# Altium project GR_Alim.PrjPCB
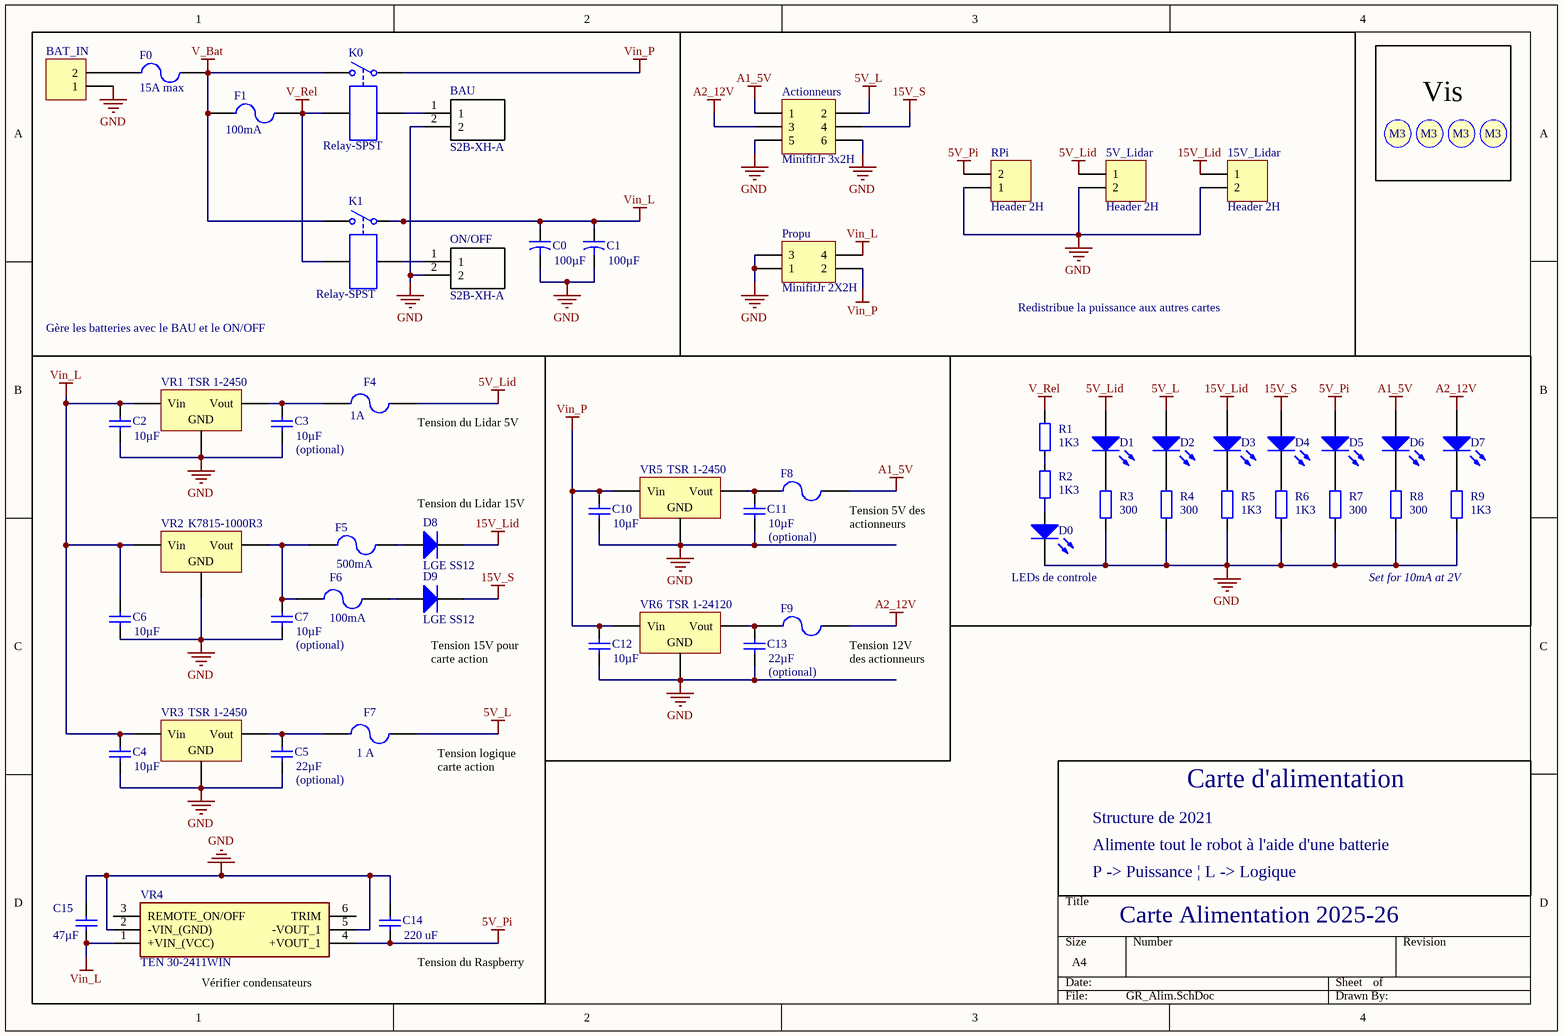
[diagram p0: GR_Alim.SchDoc]
1 sheet, 61 parts. Net scope: global (net labels, ports and power ports of the same name join across sheets).
Board file: GR_Alim.PcbDoc

## Sheet GR_Alim.SchDoc
size A4

### Parts
5V_Lidar  Header 2H  [S2B-XH-A]
15V_Lidar  Header 2H  [S2B-XH-A]
Actionneurs  MinifitJr 3x2H  [MOLEX_MINIFITJR_3X2]
BAT_IN  Battery Onboard Solder  [Battery SALE]  (value not drawn)
BAU  S2B-XH-A  [S2B-XH-A]
C0  value 100µF  [Condensateur]  (hidden comment: Cap2)
C1  value 100µF  [Condensateur]  (hidden comment: Cap2)
C2  value 10µF  [Capacitor 1206]  (hidden comment: Cap)
C3  (optional)  value 10µF  [Capacitor 1206]
C4  value 10µF  [Capacitor 1206]  (hidden comment: Cap)
C5  (optional)  value 22µF  [Capacitor 1206]
C6  value 10µF  [Capacitor 1206]  (hidden comment: Cap)
C7  (optional)  value 10µF  [Capacitor 1206]
C10  value 10µF  [Capacitor 1206]  (hidden comment: Cap)
C11  (optional)  value 10µF  [Capacitor 1206]
C12  value 10µF  [Capacitor 1206]  (hidden comment: Cap)
C13  (optional)  value 22µF  [Capacitor 1206]
C14  value 220 uF  [Capacitor 1206]  (hidden comment: Cap)
C15  value 47µF  [Capacitor 1206]  (hidden comment: Cap)
D0  V_Rel  [KP-3216SEC]  (value not drawn)
D1  5V_L  [KP-3216SEC]  (value not drawn)
D2  5V_Lid  [KP-3216SEC]  (value not drawn)
D3  A_2  [KP-3216SEC]  (value not drawn)
D4  5V_L  [KP-3216SEC]  (value not drawn)
D5  5V_L  [KP-3216SEC]  (value not drawn)
D6  A_1  [KP-3216SEC]  (value not drawn)
D7  A_2_12V  [KP-3216SEC]  (value not drawn)
D8  LGE SS12  [SMB]
D9  LGE SS12  [SMB]
F0  15A max  [Fuse]
F1  100mA  [3.5X2.8X1.9]
F4  1A  [3.5X2.8X1.9]
F5  500mA  [3.5X2.8X1.9]
F6  100mA  [3.5X2.8X1.9]
F7  1 A  [3.5X2.8X1.9]
F8  Fuse 2  [3.5X2.8X1.9]  (value not drawn)
F9  Fuse 2  [3.5X2.8X1.9]  (value not drawn)
K0  Relay-SPST  [Relay]
K1  Relay-SPST  [Relay]
ON/OFF  S2B-XH-A  [S2B-XH-A]
Propu  MinifitJr 2X2H  [MOLEX_MINIFITJR_2X2H]
R1  value 1K3  [Resistor 1206]  (hidden comment: Res2)
R2  value 1K3  [Resistor 1206]  (hidden comment: Res2)
R3  value 300  [Resistor 1206]  (hidden comment: Res2)
R4  value 300  [Resistor 1206]  (hidden comment: Res2)
R5  value 1K3  [Resistor 1206]  (hidden comment: Res2)
R6  value 1K3  [Resistor 1206]  (hidden comment: Res2)
R7  value 300  [Resistor 1206]  (hidden comment: Res2)
R8  300  [Resistor 1206]
R9  1K3  [Resistor 1206]
RPi  Header 2H  [Molex_MiniFitJr_2x1H]
S1  Screw M3  [Screw M3]  (value not drawn)
S2  Screw M3  [Screw M3]  (value not drawn)
S3  Screw M3  [Screw M3]  (value not drawn)
S4  Screw M3  [Screw M3]  (value not drawn)
VR1  TSR 1-2450  [TRS]
VR2  K7815-1000R3  [TRS]
VR3  TSR 1-2450  [TRS]
VR4  TEN 30-2411WIN  [TEN302411WIN]
VR5  TSR 1-2450  [TRS]
VR6  TSR 1-24120  [TRS]

### Blocks framed on the sheet
Gère les batteries avec le BAU et le ON/OFF: BAT_IN BAU C0 C1 F0 F1 K0 K1 ON/OFF
Redistribue la puissance aux autres cartes: 5V_Lidar 15V_Lidar Actionneurs Propu RPi

### Nets
5V_L: Actionneurs.2 D2.1(A) F7.2
5V_Lid: 5V_Lidar.1 D1.1(A) F4.2
5V_Pi: C14.1 D5.1(A) RPi.2 VR4.4(+VOUT_1)
15V_Lid: 15V_Lidar.1 D3.1(A) D8.2(K)
15V_S: Actionneurs.4 D4.1(A) D9.2(K)
A1_5V: Actionneurs.1 D6.1(A) F8.2
A2_12V: Actionneurs.3 D7.1(A) F9.2
GND: 5V_Lidar.2 15V_Lidar.2 Actionneurs.5 Actionneurs.6 BAT_IN.1 BAU.2 C0.2 C1.2 C2.1 C3.1 C4.1 C5.1 C6.1 C7.1 C10.1 C11.1 C12.1 C13.1 C14.2 C15.2 D0.2(K) ON/OFF.2 Propu.1 Propu.3 R3.1 R4.1 R5.2 R6.2 R7.2 R8.2 R9.2 RPi.1 VR1.2(GND) VR2.2(GND) VR3.2(GND) VR4.2(-VIN_(GND)) VR4.5(-VOUT_1) VR5.2(GND) VR6.2(GND)
V_Bat: F0.2 F1.1 K0.2 K1.2
V_Rel: F1.2 K0.4 K1.4 R1.1
Vin_L: C0.1 C1.1 C2.2 C4.2 C6.2 C15.1 K1.1 Propu.4 VR1.1(Vin) VR2.1(Vin) VR3.1(Vin) VR4.1(+VIN_(VCC))
Vin_P: C10.2 C12.2 K0.1 Propu.2 VR5.1(Vin) VR6.1(Vin)
NetBAT_IN_2: BAT_IN.2 F0.1
NetBAU_1: BAU.1 K0.3
NetC3_2: C3.2 F4.1 VR1.3(Vout)
NetC5_2: C5.2 F7.1 VR3.3(Vout)
NetC7_2: C7.2 F5.1 F6.1 VR2.3(Vout)
NetC11_2: C11.2 F8.1 VR5.3(Vout)
NetC13_2: C13.2 F9.1 VR6.3(Vout)
NetD0_1: D0.1(A) R2.2
NetD1_2: D1.2(K) R3.2
NetD2_2: D2.2(K) R4.2
NetD3_2: D3.2(K) R5.1
NetD4_2: D4.2(K) R6.1
NetD5_2: D5.2(K) R7.1
NetD6_2: D6.2(K) R8.1
NetD7_2: D7.2(K) R9.1
NetD8_1: D8.1(A) F5.2
NetD9_1: D9.1(A) F6.2
NetK1_3: K1.3 ON/OFF.1
NetR1_2: R1.2 R2.1

Not connected (* = marked no-connect by the designer): VR4 3(REMOTE_ON/OFF) 6(TRIM)

### Notes on the sheet
- Vis
- (near F4) Tension du Lidar 5V
- Tension du Lidar 15V
- (near F8) Tension 5V des actionneurs
- LEDs de controle
- Set for 10mA at 2V
- (near D9) Tension 15V pour carte action
- (near F9) Tension 12V des actionneurs
- (near F7) Tension logique carte action
- Carte d'alimentation
- Structure de 2021
- Alimente tout le robot à l'aide d'une batterie
- P -> Puissance | L -> Logique
- Carte Alimentation 2025-26
- (near VR4) Vérifier condensateurs
- (near C14) Tension du Raspberry
- (in symbol Screw M3) M3

### Library data of the parts
5V_Lidar 15V_Lidar RPi = Header 2H: Header, 2-Pin, Right Angle; LatestRevisionDate: 17-Jul-2002; LatestRevisionNote: Re-released for DXP Platform.; Publisher: Altium Limited
Actionneurs = Header 3X2H: Header, 3-Pin, Dual row, Right Angle; LatestRevisionDate: 17-Jul-2002; LatestRevisionNote: Re-released for DXP Platform.; Publisher: Altium Limited
BAT_IN = Header 2: Header, 2-Pin / Battery Onboard Solder / 24V; LatestRevisionDate: 17-Jul-2002; LatestRevisionNote: Re-released for DXP Platform.; Publisher: Altium Limited
BAU ON/OFF = S2B-XH-A-1_LF__SN_: Connector; Manufacturer_Name: JST (JAPAN SOLDERLESS TERMINALS); Manufacturer_Part_Number: S2B-XH-A-1(LF)(SN); Datasheet Link: http://www.jst-mfg.com/product/pdf/eng/eXH.pdf; Height: 6.1mm; Arrow Part Number: S2B-XH-A-1(LF)(SN)
C0 C1 = Cap2: Capacitor; Published: 23-Sep-2002; PackageReference: CAPR5-4X5; Publisher: Altium Limited; PackageDescription: Capacitor; 2 Leads
C2-C7 C10-C15 = Cap: Capacitor; Published: 8-Jun-2000; LatestRevisionDate: 17-Jul-2002; LatestRevisionNote: Re-released for DXP Platform.; PackageReference: RAD-0.3; Publisher: Altium Limited; PackageDescription: Radial Cap, Thru-Hole; 2 Leads; 0.3 in Pin Spacing
D0-D7 = LED2: Typical RED, GREEN, YELLOW, AMBER GaAs LED; Published: 8-Jun-2000; LatestRevisionDate: 17-Jul-2002; LatestRevisionNote: Re-released for DXP Platform.; PackageVersion: Feb-2002; PackageReference: 3.2X1.6X1.1; Publisher: Altium Limited; PackageDescription: SM LED; 2 Flat Leads
D8 D9 = Diode: Default Diode; Published: 8-Jun-2000; LatestRevisionDate: 17-Jul-2002; LatestRevisionNote: Re-released for DXP Platform.; PackageVersion: Sep-1996; PackageReference: SMC; Publisher: Altium Limited; PackageDescription: DO-214-AB/SMC; 2 C-Bend Leads; Body 7.9 x 5.9 mm, inc. leads (LxW); Code_JEDEC: DO-214-AB
F0 = Fuse 2: Main Fuse; Published: 8-Jun-2000; LatestRevisionDate: 17-Jul-2002; LatestRevisionNote: Re-released for DXP Platform.; PackageReference: PIN-W2/E2.8; Publisher: Altium Limited; PackageDescription: Thru-Hole; 2 Leads
F1 = Fuse 2: Resettable fuse T0; Published: 8-Jun-2000; LatestRevisionDate: 17-Jul-2002; LatestRevisionNote: Re-released for DXP Platform.; PackageReference: PIN-W2/E2.8; Publisher: Altium Limited; PackageDescription: Thru-Hole; 2 Leads
F4 F5 = Fuse 2: Resettable Fuse αA / JF; Published: 8-Jun-2000; LatestRevisionDate: 17-Jul-2002; LatestRevisionNote: Re-released for DXP Platform.; PackageReference: PIN-W2/E2.8; Publisher: Altium Limited; PackageDescription: Thru-Hole; 2 Leads
F6 = Fuse 2: Resettable Fuse T0; Published: 8-Jun-2000; LatestRevisionDate: 17-Jul-2002; LatestRevisionNote: Re-released for DXP Platform.; PackageReference: PIN-W2/E2.8; Publisher: Altium Limited; PackageDescription: Thru-Hole; 2 Leads
F7 = Fuse 2: Resettable fuse JG / BF; Published: 8-Jun-2000; LatestRevisionDate: 17-Jul-2002; LatestRevisionNote: Re-released for DXP Platform.; PackageReference: PIN-W2/E2.8; Publisher: Altium Limited; PackageDescription: Thru-Hole; 2 Leads
F8 F9 = Fuse 2: Résistance 0Ω; Published: 8-Jun-2000; LatestRevisionDate: 17-Jul-2002; LatestRevisionNote: Re-released for DXP Platform.; PackageReference: PIN-W2/E2.8; Publisher: Altium Limited; PackageDescription: Thru-Hole; 2 Leads
K0 K1 = Relay-SPST: Single-Pole Single-Throw Relay; Published: 24-Mar-1999; LatestRevisionDate: 17-Jul-2002; LatestRevisionNote: Re-released for DXP Platform.; PackageReference: MODULE4; Publisher: Altium Limited
Propu = Header 2X2H: Header, 2-Pin, Dual row, Right Angle; LatestRevisionDate: 17-Jul-2002; LatestRevisionNote: Re-released for DXP Platform.; Publisher: Altium Limited
R1-R9 = Res2: Resistor; Published: 8-Jun-2000; LatestRevisionDate: 17-Jul-2002; LatestRevisionNote: Re-released for DXP Platform.; PackageReference: AXIAL-0.4; Publisher: Altium Limited; PackageDescription: Axial Device, Thru-Hole; 2 Leads; 0.4 in Pin Spacing
VR1-VR3 VR5 VR6 = Volt Reg: Voltage Regulator; Published: 24-Mar-1999; LatestRevisionDate: 29-May-2009; LatestRevisionNote: IPC-7351 Footprint Added.; PackageReference: D2PAK; Publisher: Altium Limited; PackageDescription: 3-Pin Transistor Outline Package 2.54 mm Pitch, 15.1 mm Lead Span
VR4 = TEN_30-2411WIN: Power Supply; Manufacturer_Name: Traco Power; Datasheet Link: https://tracopower.com/ten30win-datasheet/; Height: 10.7mm; Manufacturer_Part_Number: TEN 30-2411WIN; Mouser Part Number: 495-TEN-30-2411WIN; Mouser Price/Stock: https://www.mouser.co.uk/ProductDetail/TRACO-Power/TEN-30-2411WIN?qs=ckJk83FOD0WILf%252BNmub5Yg%3D%3D